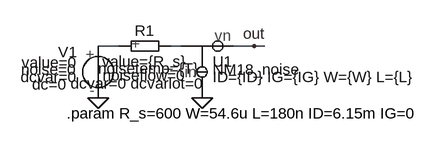
[diagram p0: schematic CSresNoise.asc]
CSresNoise.asc, the LTspice schematic file:
Version 4
SHEET 1 880 680
WIRE 64 48 32 48
WIRE 160 48 144 48
WIRE 272 48 240 48
WIRE 288 48 272 48
FLAG 32 128 0
FLAG 192 128 0
FLAG 272 48 out
SYMBOL SLV 32 48 M0
WINDOW 123 48 59 Left 2
WINDOW 39 32 48 Left 2
WINDOW 40 33 36 Left 2
SYMATTR InstName V1
SYMBOL SLR 64 48 R270
WINDOW 0 8 40 VTop 2
WINDOW 3 -8 40 VBottom 2
WINDOW 123 -19 47 VBottom 2
WINDOW 39 -30 39 VBottom 2
WINDOW 40 -42 29 VBottom 2
SYMATTR InstName R1
SYMATTR Value value={R_s}
SYMATTR Value2 noisetemp={T}
SYMBOL SLM_noise 240 32 R0
WINDOW 0 -32 40 Left 2
WINDOW 38 -32 52 Left 2
SYMATTR InstName U1
SYMATTR SpiceModel NM18_noise
TEXT -16 152 Left 2 !.param R_s=600 W=54.6u L=180n ID=6.15m IG=0

The netlist it stands for:
* CSresNoise.asc
V1 N001 0 V value=0 dc=0 dcvar=0 noise=0
R1 N001 N002 R value={R_s} noisetemp={T} noiseflow=0 dcvar=0 dcvarlot=0
XU1 N002 0 out NM18_noise ID={ID} IG={IG} W={W} L={L}  ; pins ext comm int
.param R_s=600 W=54.6u L=180n ID=6.15m IG=0
.backanno
.end